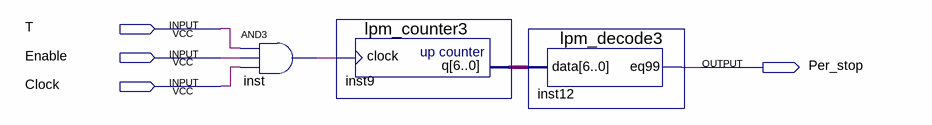
[diagram p0: schematic sheet]
// Quartus schematic period_cnt.bdf as structural Verilog: 3 symbols, 4 pins
module period_cnt (
  input  T,
  input  Enable,
  input  Clock,
  output Per_stop
);

  wire inst_out;
  wire [6:0] inst9_q;

  and inst (inst_out, T, Enable, Clock);
  lpm_counter3 inst9 (.clock(inst_out), .q(inst9_q));
  lpm_decode3 inst12 (.data(inst9_q), .eq99(Per_stop));
endmodule
